# Altium schematic sheet Altium_radio.SchDoc
size A4
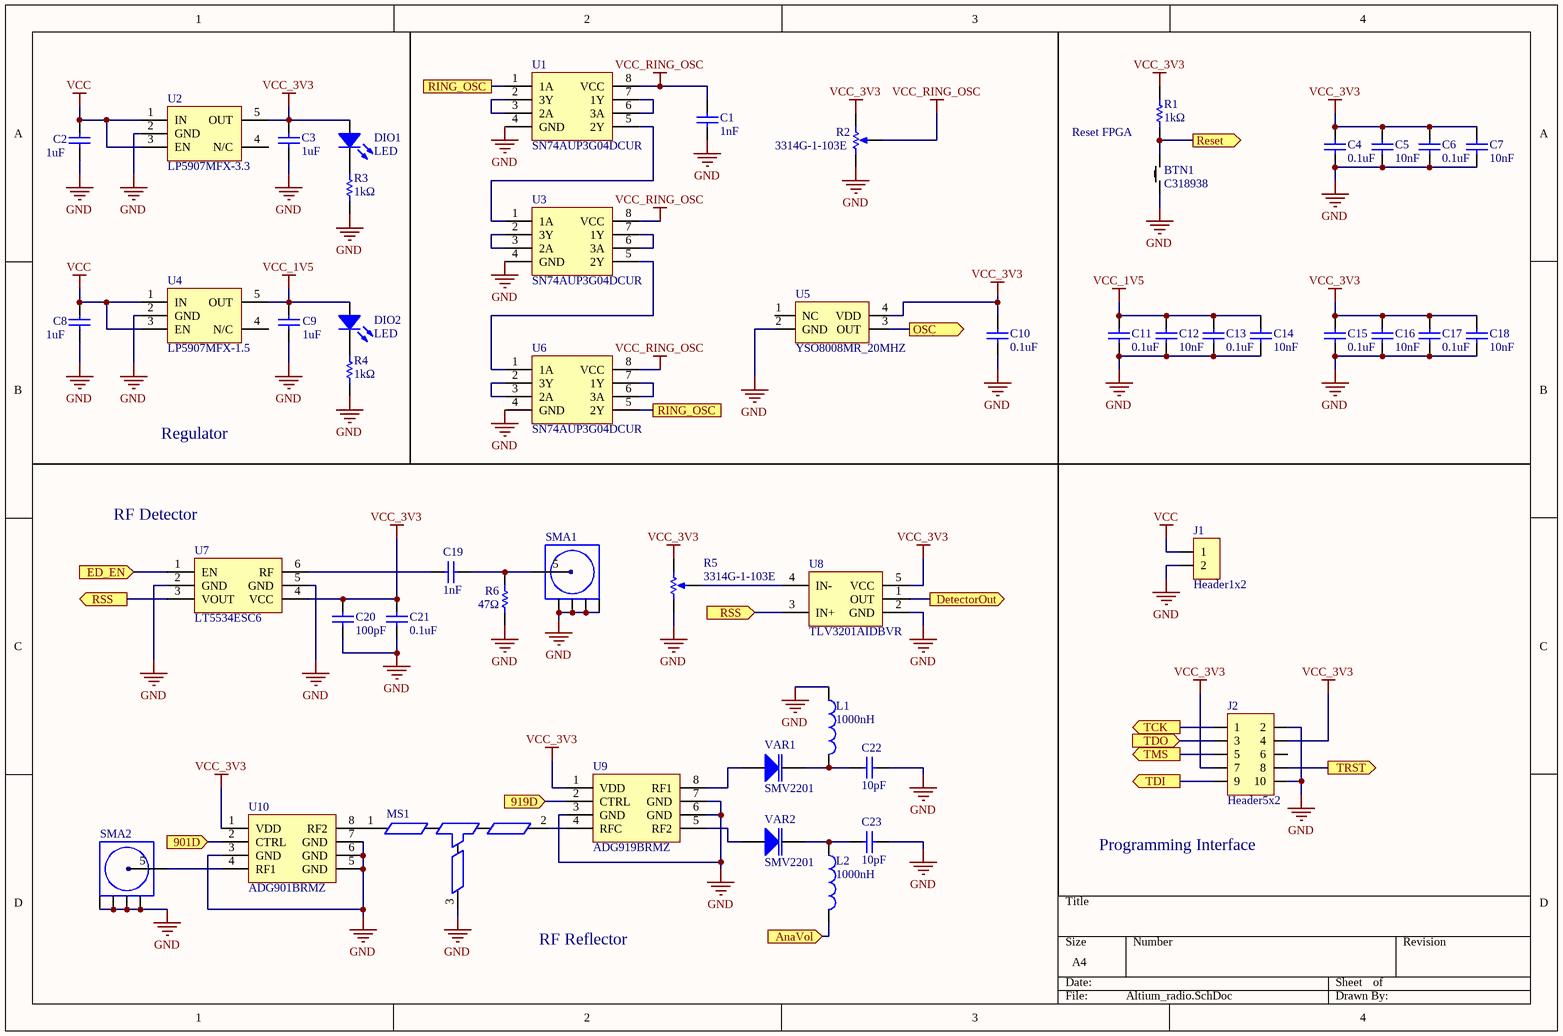
[diagram p0: Altium_radio.SchDoc]

## Parts
BTN1  C318938  [C318938]
C1  1nF  [C0603]
C2  1uF  [C0603]
C3  1uF  [C0603]
C4  0.1uF  [C0603]
C5  10nF  [C0603]
C6  0.1uF  [C0603]
C7  10nF  [C0603]
C8  1uF  [C0603]
C9  1uF  [C0603]
C10  0.1uF  [C0603]
C11  0.1uF  [C0603]
C12  10nF  [C0603]
C13  0.1uF  [C0603]
C14  10nF  [C0603]
C15  0.1uF  [C0603]
C16  10nF  [C0603]
C17  0.1uF  [C0603]
C18  10nF  [C0603]
C19  1nF  [C0603]
C20  100pF  [C0402]
C21  0.1uF  [C0603]
C22  10pF  [C0402]
C23  10pF  [C0402]
DIO1  LED  [LED0603]
DIO2  LED  [LED0603]
J1  Header1x2  [Header1x2]
J2  Header5x2  [Header2x5]
L1  1000nH  [L0805]
L2  1000nH  [L0805]
MS1  MSTEE  [MTEE_SMA]  (value not drawn)  (net tie, no BOM)
R1  1kΩ  [R0603]
R2  3314G-1-103E  [3314G-1-103E]
R3  1kΩ  [R0603]
R4  1kΩ  [R0603]
R5  3314G-1-103E  [3314G-1-103E]
R6  47Ω  [R0603]
SMA1  SMA  [HJ-SMA305]  (value not drawn)
SMA2  SMA  [HJ-SMA305]  (value not drawn)
U1  SN74AUP3G04DCUR  [SN74AUP3G04DCUR]
U2  LP5907MFX-3.3  [LP5907MFX-3.3]
U3  SN74AUP3G04DCUR  [SN74AUP3G04DCUR]
U4  LP5907MFX-1.5  [LP5907MFX-1.5]
U5  YSO8008MR_20MHZ  [YSO8008MR_20MHz]
U6  SN74AUP3G04DCUR  [SN74AUP3G04DCUR]
U7  LT5534ESC6  [LT5534ESC6#TRPBF]
U8  TLV3201AIDBVR  [TLV3201AIDBVR]
U9  ADG919BRMZ  [ADG919BRMZ]
U10  ADG901BRMZ  [ADG901BRMZ-REEL7]
VAR1  SMV2201  [D0402]
VAR2  SMV2201  [D0402]

## Ports
901D (in), 919D (in), AnaVol (in), DetectorOut (out), ED_EN (in), OSC (out), Reset (out), RING_OSC, RSS (in), RSS (out), TCK (out), TDI (out), TDO (in), TMS (out), TRST (out)

## Nets
GND: BTN1.1 C1.1 C2.1 C3.1 C4.2 C5.2 C6.2 C7.2 C8.1 C9.1 C10.2 C11.2 C12.2 C13.2 C14.2 C15.2 C16.2 C17.2 C18.2 C20.1 C21.1 C22.2 C23.2 J1.2 J2.2 J2.10 L1.1 MS1.3 R2.3(CW) R3.1 R4.1 R5.3(CW) R6.1 SMA1.1(GND) SMA1.2(GND) SMA1.3(GND) SMA1.4(GND) SMA2.1(GND) SMA2.2(GND) SMA2.3(GND) SMA2.4(GND) U1.4(GND) U2.2(GND) U3.4(GND) U4.2(GND) U5.2(GND) U6.4(GND) U7.2(GND) U7.5(GND) U8.2(GND) U9.3(GND) U9.6(GND) U9.7(GND) U10.3(GND) U10.5(GND) U10.6(GND) U10.7(GND)
VCC: C2.2 C8.2 J1.1 U2.1(IN) U2.3(EN) U4.1(IN) U4.3(EN)
VCC_1V5: C9.2 C11.1 C12.1 C13.1 C14.1 DIO2.1 U4.5(OUT)
VCC_3V3: C3.2 C4.1 C5.1 C6.1 C7.1 C10.1 C15.1 C16.1 C17.1 C18.1 C20.2 C21.2 DIO1.1 J2.4 J2.7 R1.2 R2.1(CCW) R5.1(CCW) U2.5(OUT) U5.4(VDD) U7.4(VCC) U8.5(VCC) U9.1(VDD) U10.1(VDD)
VCC_RING_OSC: C1.2 R2.2(WIPER) U1.8(VCC) U3.8(VCC) U6.8(VCC)
901D: U10.2(CTRL) ; port 901D
919D: U9.2(CTRL) ; port 919D
AnaVol: L2.2 ; port AnaVol
DetectorOut: U8.1(OUT) ; port DetectorOut
ED_EN: U7.1(EN) ; port ED_EN
OSC: U5.3(OUT) ; port OSC
Reset: BTN1.2 R1.1 ; port Reset
RING_OSC: U1.1(1A) U6.5(2Y) ; port RING_OSC
RSS: U7.3(VOUT) U8.3(IN+) ; port RSS
TCK: J2.1 ; port TCK
TDI: J2.9 ; port TDI
TDO: J2.3 ; port TDO
TMS: J2.5 ; port TMS
TRST: J2.8 ; port TRST
NetC19_1: C19.1 U7.6(RF)
NetC19_2: C19.2 R6.2 SMA1.5(SMA_CON)
NetC22_1: C22.1 L1.2 VAR1.1(K)
NetC23_1: C23.1 L2.1 VAR2.1(K)
NetDIO1_2: DIO1.2 R3.2
NetDIO2_2: DIO2.2 R4.2
NetMS1_1: MS1.1 U10.8(RF2)
NetMS1_2: MS1.2 U9.4(RFC)
NetR5_2: R5.2(WIPER) U8.4(IN-)
NetSMA2_5: SMA2.5(SMA_CON) U10.4(RF1)
NetU1_2: U1.2(3Y) U1.3(2A)
NetU1_5: U1.5(2Y) U3.1(1A)
NetU1_6: U1.6(3A) U1.7(1Y)
NetU3_2: U3.2(3Y) U3.3(2A)
NetU3_5: U3.5(2Y) U6.1(1A)
NetU3_6: U3.6(3A) U3.7(1Y)
NetU6_2: U6.2(3Y) U6.3(2A)
NetU6_6: U6.6(3A) U6.7(1Y)
NetU9_5: U9.5(RF2) VAR2.2(A)
NetU9_8: U9.8(RF1) VAR1.2(A)

Not connected (* = marked no-connect by the designer): J2 6; U2 4(N/C); U4 4(N/C); U5 1(NC)

## Notes on the sheet
- Reset FPGA
- Regulator
- (near U7) RF Detector
- Programming Interface
- (near MS1) RF Reflector

## Library data of the parts
C1-C23 = Cap
L1 L2 = Inductor
R1 R3 R4 R6 = Res
VAR1 VAR2 = VAR